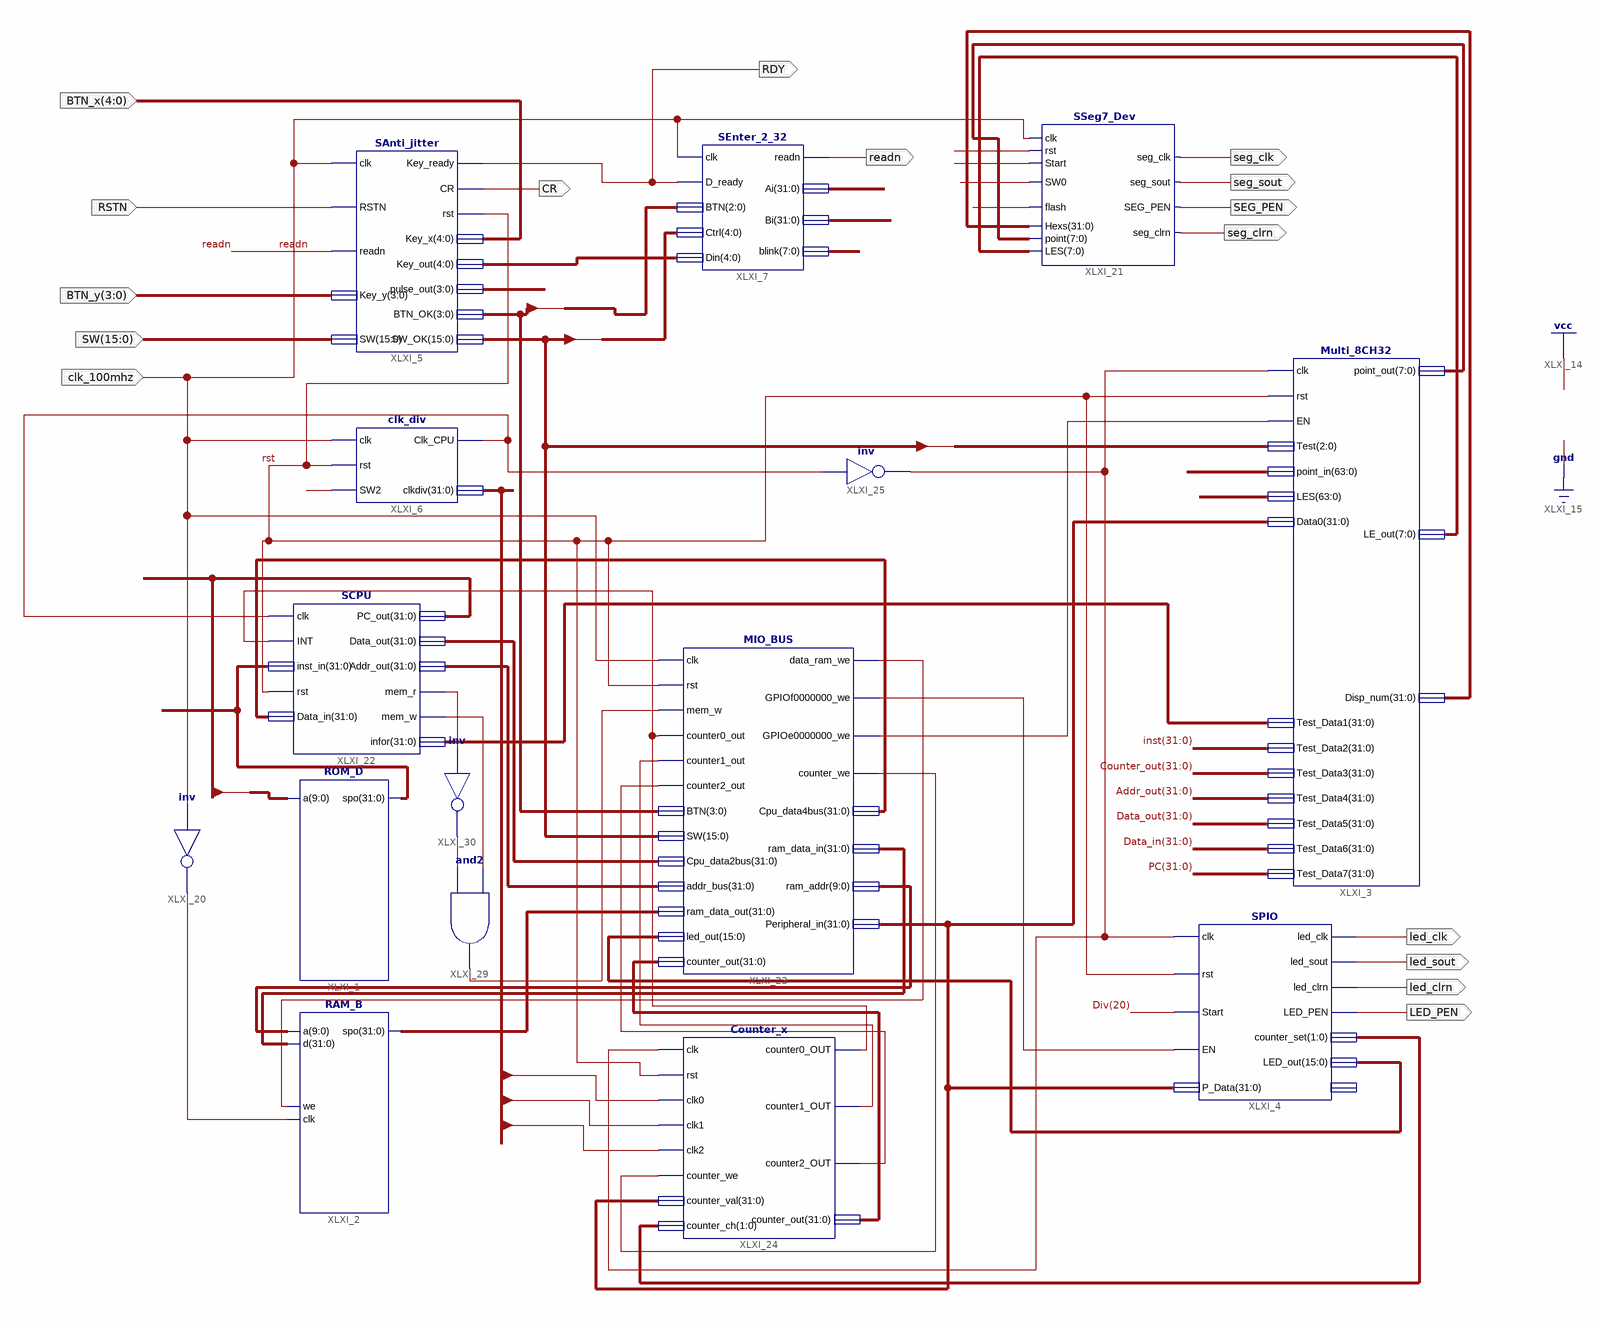
[diagram p0: schematic sheet 1]
// Xilinx ISE schematic lab2.sch (kintex7) as structural Verilog: 15 symbols, 16 ports
module lab2 (
  input  RSTN,
  input  [3:0] BTN_y,
  input  [4:0] BTN_x,
  input  [15:0] SW,
  input  clk_100mhz,
  output CR,
  output RDY,
  output readn,
  output led_clk,
  output led_sout,
  output led_clrn,
  output LED_PEN,
  output seg_clk,
  output seg_clrn,
  output seg_sout,
  output SEG_PEN
);

  wire Clk_CPU, GPIOF0, IO_clk, rst, XLXN_61, XLXN_95, XLXN_99, XLXN_106, XLXN_107, XLXN_108, XLXN_115,
       XLXN_118, XLXN_122, XLXN_123, XLXN_124;
  wire [1:0] XLXN_110;
  wire [3:0] BTN_OK, Pulse;
  wire [4:0] XLXN_9;
  wire [7:0] blink, LE_out, point_out;
  wire [9:0] XLXN_93;
  wire [15:0] LED_out, SW_OK;
  wire [31:0] Addr_out, Ai, Bi, Counter_out, CPU2IO, Data_in, Data_out, Disp_num, Div, inst, PC, XLXN_94,
       XLXN_96, XLXN_133;

  ROM_D XLXI_1 (.a(PC[11:2]), .spo(inst));
  RAM_B XLXI_2 (.a(XLXN_93), .d(XLXN_94), .we(XLXN_95), .clk(XLXN_61), .spo(XLXN_96));
  SAnti_jitter XLXI_5 (
    .clk(clk_100mhz), .RSTN(RSTN), .readn(readn), .Key_y(BTN_y), .SW(SW), .Key_ready(RDY), .CR(CR),
    .rst(rst), .Key_x(BTN_x), .Key_out(XLXN_9), .pulse_out(Pulse), .BTN_OK(BTN_OK), .SW_OK(SW_OK));
  clk_div XLXI_6 (.clk(clk_100mhz), .rst(rst), .SW2(SW_OK[2]), .Clk_CPU(Clk_CPU), .clkdiv(Div));
  SEnter_2_32 XLXI_7 (
    .clk(clk_100mhz), .D_ready(RDY), .BTN(BTN_OK[2:0]), .Ctrl({SW_OK[7:5], SW_OK[15], SW_OK[0]}),
    .Din(XLXN_9), .readn(readn), .Ai(Ai), .Bi(Bi), .blink(blink));
  Multi_8CH32 XLXI_3 (
    .clk(IO_clk), .rst(rst), .EN(XLXN_99), .Test(SW_OK[7:5]), .point_in({Div, Div}), .LES({64{1'b0}}),
    .Data0(CPU2IO), .Test_Data1(XLXN_133), .Test_Data2(inst), .Test_Data3(Counter_out),
    .Test_Data4(Addr_out), .Test_Data5(Data_out), .Test_Data6(Data_in), .Test_Data7(PC),
    .point_out(point_out), .LE_out(LE_out), .Disp_num(Disp_num));
  not XLXI_20 (XLXN_61, clk_100mhz);
  SPIO XLXI_4 (
    .clk(IO_clk), .rst(rst), .Start(Div[20]), .EN(GPIOF0), .P_Data(CPU2IO), .led_clk(led_clk),
    .led_sout(led_sout), .led_clrn(led_clrn), .LED_PEN(LED_PEN), .counter_set(XLXN_110), .LED_out(LED_out));  // open: GPIOf0
  SCPU XLXI_22 (
    .clk(Clk_CPU), .INT(XLXN_115), .inst_in(inst), .rst(rst), .Data_in(Data_in), .PC_out(PC),
    .Data_out(Data_out), .Addr_out(Addr_out), .mem_r(XLXN_118), .mem_w(XLXN_122), .infor(XLXN_133));
  MIO_BUS XLXI_23 (
    .clk(clk_100mhz), .rst(rst), .mem_w(XLXN_124), .counter0_out(XLXN_115), .counter1_out(XLXN_106),
    .counter2_out(XLXN_107), .BTN(BTN_OK), .SW(SW_OK), .Cpu_data2bus(Data_out), .addr_bus(Addr_out),
    .ram_data_out(XLXN_96), .led_out(LED_out), .counter_out(Counter_out), .data_ram_we(XLXN_95),
    .GPIOf0000000_we(GPIOF0), .GPIOe0000000_we(XLXN_99), .counter_we(XLXN_108), .Cpu_data4bus(Data_in),
    .ram_data_in(XLXN_94), .ram_addr(XLXN_93), .Peripheral_in(CPU2IO));
  Counter_x XLXI_24 (
    .clk(IO_clk), .rst(rst), .clk0(Div[6]), .clk1(Div[9]), .clk2(Div[11]), .counter_we(XLXN_108),
    .counter_val(CPU2IO), .counter_ch(XLXN_110), .counter0_OUT(XLXN_115), .counter1_OUT(XLXN_106),
    .counter2_OUT(XLXN_107), .counter_out(Counter_out));
  not XLXI_25 (IO_clk, Clk_CPU);
  SSeg7_Dev XLXI_21 (
    .LES(LE_out), .SEG_PEN(SEG_PEN), .seg_sout(seg_sout), .seg_clrn(seg_clrn), .point(point_out),
    .Hexs(Disp_num), .SW0(SW_OK[0]), .flash(Div[25]), .seg_clk(seg_clk), .clk(clk_100mhz), .rst(rst),
    .Start(Div[20]));
  and XLXI_29 (XLXN_124, XLXN_123, XLXN_122);
  not XLXI_30 (XLXN_123, XLXN_118);
endmodule
